# Altium schematic sheet ETH-PHY.SchDoc: TEBF0808 - ETHERNET
size A4; Organization: Trenz Electronic GmbH; DocumentNumber: TEBF0808; Revision: 04; SheetNumber: 20; SheetTotal: 36; Date: 2016-09-29; CompanyName: Trenz Electronic GmbH
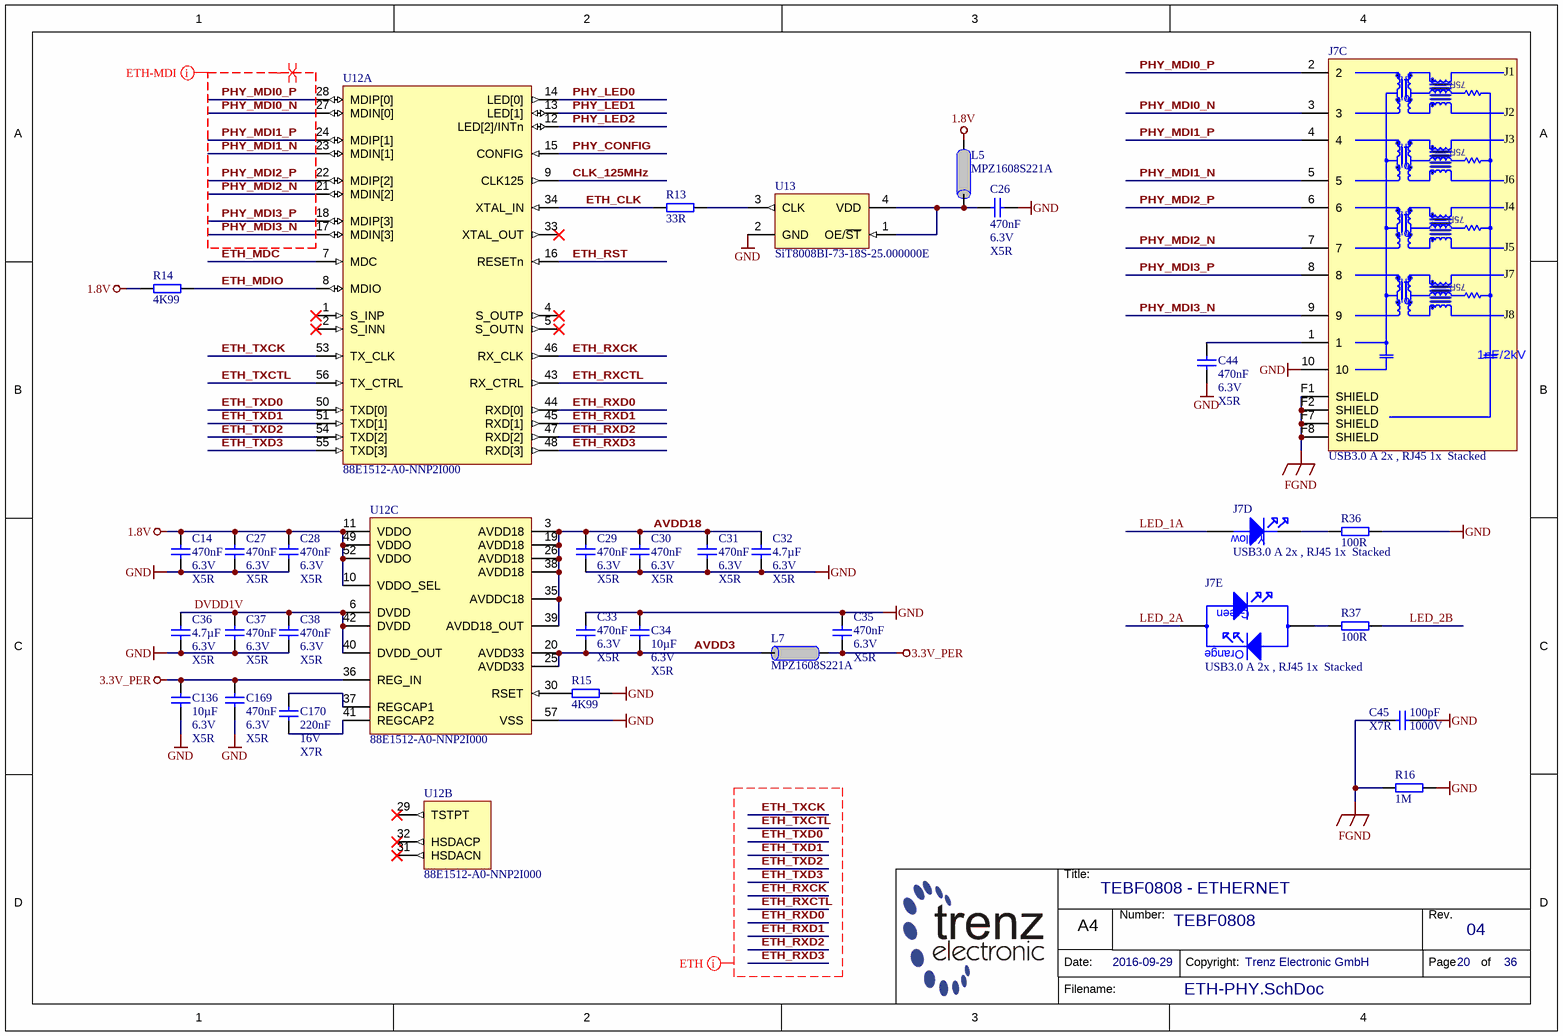
[diagram p0: ETH-PHY.SchDoc]

## Parts
C14  470nF  Voltage: 6.3V  Technology: X5R  [CAPC1005X55N]
C26  470nF  Voltage: 6.3V  Technology: X5R  [CAPC1005X55N]
C27  470nF  Voltage: 6.3V  Technology: X5R  [CAPC1005X55N]
C28  470nF  Voltage: 6.3V  Technology: X5R  [CAPC1005X55N]
C29  470nF  Voltage: 6.3V  Technology: X5R  [CAPC1005X55N]
C30  470nF  Voltage: 6.3V  Technology: X5R  [CAPC1005X55N]
C31  470nF  Voltage: 6.3V  Technology: X5R  [CAPC1005X55N]
C32  4.7µF  Voltage: 6.3V  Technology: X5R  [CAPC1005X60N]
C33  470nF  Voltage: 6.3V  Technology: X5R  [CAPC1005X55N]
C34  10µF  Voltage: 6.3V  Technology: X5R  [CAPC1608X90N]
C35  470nF  Voltage: 6.3V  Technology: X5R  [CAPC1005X55N]
C36  4.7µF  Voltage: 6.3V  Technology: X5R  [CAPC1005X60N]
C37  470nF  Voltage: 6.3V  Technology: X5R  [CAPC1005X55N]
C38  470nF  Voltage: 6.3V  Technology: X5R  [CAPC1005X55N]
C44  470nF  Voltage: 6.3V  Technology: X5R  [CAPC1005X55N]
C45  100pF  Voltage: X7R  Technology: 1000V  [CAPC3216X180N]
C136  10µF  Voltage: 6.3V  Technology: X5R  [CAPC1608X90N]
C169  470nF  Voltage: 6.3V  Technology: X5R  [CAPC1005X55N]
C170  220nF  Voltage: 16V  Technology: X7R  [CAPC1005X55N]
J7  USB3.0 A 2x , RJ45 1x  Stacked  [7497110616]  (parts C,D,E of 5)
L5  MPZ1608S221A  [INDC1608X95N]
L7  MPZ1608S221A  [INDC1608X95N]
R13  33R  [RESC1005X40N]
R14  4K99  [RESC1005X40N]
R15  4K99  [RESC1005X40N]
R16  1M  [RESC3216X65N]
R36  100R  [RESC1005X40N]
R37  100R  [RESC1005X40N]
U12  88E1512-A0-NNP2I000  [QFN50P800X800X100-57N]  (parts A,B,C of 3)
U13  SiT8008BI-73-18S-25.000000E  [2016]

## Nets
1.8V: C14.1 C27.1 C28.1 L5.1 R14.1 U12.10(VDDO_SEL) U12.11(VDDO) U12.49(VDDO) U12.52(VDDO)
3.3V_PER: C35.2 C136.1 C169.1 L7.1 U12.36(REG_IN)
FGND: C45.1 J7.F1(SHIELD) J7.F2(SHIELD) J7.F7(SHIELD) J7.F8(SHIELD) R16.1
GND: C14.2 C26.2 C27.2 C28.2 C29.2 C30.2 C31.2 C32.2 C33.1 C34.1 C35.1 C36.2 C37.2 C38.2 C44.2 C45.2 C136.2 C169.2 J7.10 R15.2 R16.2 R36.2 U12.57(VSS) U13.2(GND)
AVDD3: C33.2 C34.2 L7.2 U12.20(AVDD33) U12.25(AVDD33)
AVDD18: C29.1 C30.1 C31.1 C32.1 U12.3(AVDD18) U12.19(AVDD18) U12.26(AVDD18) U12.35(AVDDC18) U12.38(AVDD18) U12.39(AVDD18_OUT)
CLK_125MHz: U12.9(CLK125)
DVDD1V: C36.1 C37.1 C38.1 U12.6(DVDD) U12.40(DVDD_OUT) U12.42(DVDD)
ETH_CLK: R13.1 U12.34(XTAL_IN)
ETH_MDC: U12.7(MDC)
ETH_MDIO: R14.2 U12.8(MDIO)
ETH_RST: U12.16(RESETn)
ETH_RXCK: U12.46(RX_CLK)
ETH_RXCTL: U12.43(RX_CTRL)
ETH_RXD0: U12.44(RXD[0])
ETH_RXD1: U12.45(RXD[1])
ETH_RXD2: U12.47(RXD[2])
ETH_RXD3: U12.48(RXD[3])
ETH_TXCK: U12.53(TX_CLK)
ETH_TXCTL: U12.56(TX_CTRL)
ETH_TXD0: U12.50(TXD[0])
ETH_TXD1: U12.51(TXD[1])
ETH_TXD2: U12.54(TXD[2])
ETH_TXD3: U12.55(TXD[3])
LED_1A: J7.12
LED_2A: J7.14
LED_2B: R37.2
PHY_CONFIG: U12.15(CONFIG)
PHY_LED0: U12.14(LED[0])
PHY_LED1: U12.13(LED[1])
PHY_LED2: U12.12(LED[2]/INTn)
PHY_MDI0_N: J7.3 U12.27(MDIN[0])
PHY_MDI0_P: J7.2 U12.28(MDIP[0])
PHY_MDI1_N: J7.5 U12.23(MDIN[1])
PHY_MDI1_P: J7.4 U12.24(MDIP[1])
PHY_MDI2_N: J7.7 U12.21(MDIN[2])
PHY_MDI2_P: J7.6 U12.22(MDIP[2])
PHY_MDI3_N: J7.9 U12.17(MDIN[3])
PHY_MDI3_P: J7.8 U12.18(MDIP[3])
NetC26_1: C26.1 L5.2 U13.1(OE/~{ST}) U13.4(VDD)
NetC44_1: C44.1 J7.1
NetC170_1: C170.1 U12.37(REGCAP1)
NetC170_2: C170.2 U12.41(REGCAP2)
NetJ7_11: J7.11 R36.1
NetJ7_13: J7.13 R37.1
NetR13_2: R13.2 U13.3(CLK)
NetR15_1: R15.1 U12.30(RSET)

Not connected (* = marked no-connect by the designer): U12 1(S_INP)* 2(S_INN)* 4(S_OUTP)* 5(S_OUTN)* 29(TSTPT)* 31(HSDACN)* 32(HSDACP)* 33(XTAL_OUT)*

## Layout directives
differential pair: PHY_MDI0_N, PHY_MDI0_P, PHY_MDI1_N, PHY_MDI1_P, PHY_MDI2_N, PHY_MDI2_P, PHY_MDI3_N, PHY_MDI3_P
net class ETH-MDI: PHY_MDI0_N, PHY_MDI0_P, PHY_MDI1_N, PHY_MDI1_P, PHY_MDI2_N, PHY_MDI2_P, PHY_MDI3_N, PHY_MDI3_P
net class ETH: ETH_RXCK, ETH_RXCTL, ETH_RXD0, ETH_RXD1, ETH_RXD2, ETH_RXD3, ETH_TXCK, ETH_TXCTL, ETH_TXD0, ETH_TXD1, ETH_TXD2, ETH_TXD3

## Notes on the sheet
- Title:
- Number:
- Rev.
- Date:
- A4
- Copyright:
- Page
- of
- Filename:
- (in symbol 27271, part C) 75R; J1; J2; J3; J6; J4; J5; J8; 1nF/2kV
- (in symbol 27271, part D) Yellow
- (in symbol 27271, part E) Green; Orange

## Library data of the parts
C14 C26-C31 C33 C35 C37 C38 C169 = 23659: KON 470nF 6,3V X5R SMD; AN: 23659; Value: 470n; Mixed: SMT; Preferred: Yes; Case: 1005 (0402)
C32 C36 = 24719: KON 4.7µF 6.3V X5R SMD 20%; AN: 24719; Value: 4.7u; Mixed: SMT; Preferred: Yes; Case: 1005 (0402); Tolerance: 20%
C34 C136 = 22918: KON 10µF 6,3V X5R SMD; AN: 22918; Mixed: SMT; Value: 10u; Case: 1608 (0603)
C44 = 23659: KON 470nF 6,3V X5R SMD; AN: 23659; Mixed: SMT; Value: 470n; Preferred: Yes; Case: 1005 (0402)
C45 = 22679: KON 100pF 1000V X7R 10%; AN: 22679; Value: 100p; Preferred: Yes; Mixed: SMT; Case: 3216 (1206); Tolerance: 10%
C170 = 22768: KON 220nF 16V X7R SMD; AN: 22768; Mixed: SMT; Value: 220n; Case: 1005 (0402)
J7 = 27271: AN: 27271; Mixed: THT; Trenz-Stock: Yes; HelpURL: B:\AD\adlib\datasheet\7497110616; H-ART: 7497110616
L5 L7 = 22718: Ferritdurchführung MPZ1608S221A; AN: 22718; Mixed: SMT; Trenz-Stock: Yes; Value: 220 OHm @ 100MHz; Case: 1608 (0603); HelpURL: B:\AD\adlib\datasheet\MPZ1608; Preferred: Yes; H-ART: MPZ1608S221A
R13 = 22770: WID SMD 33R 1% 0,063W; AN: 22770; Mixed: SMT; Value: 33; Preferred: Yes; Tolerance: 1%; Case: 1005 (0402); Technology: TK100
R14 = 22754: WID SMD 4K99 1% 0,063W; AN: 22754; Mixed: SMT; Value: 4.99K; Preferred: Yes; Case: 1005 (0402); Tolerance: 1%; Technology: TK100
R15 = 22754: WID SMD 4K99 1% 0,063W; AN: 22754; Value: 4.99K; Mixed: SMT; Preferred: Yes; Case: 1005 (0402); Tolerance: 1%; Technology: TK100
R16 = 22757: WID SMD 1M 5% 0,25W; AN: 22757; Mixed: SMT; Preferred: Yes; Case: 3216 (1206); Value: 1M; Tolerance: 5%; Technology: TK100
R36 R37 = 22507: WID SMD 100R 1% 0,063W; AN: 22507; Mixed: SMT; Value: 100; Preferred: Yes; Case: 1005 (0402); Tolerance: 1%; Technology: TK100
U12 = 24652: AN: 24652; Trenz-Stock: Yes; Mixed: SMT; Case: QFN56; HelpURL: B:\AD\adlib\datasheet\NDA\88E1512; Preferred: Yes; H-ART: 88E1512-A0-NNP2I000
U13 = 27228: AN: 27228; Value: 25M; Mixed: SMT; Preferred: Yes; Voltage: 1.8V; Case: 2.0  x 1.6mm; HelpURL: B:\AD\adlib\datasheet\SiT8008; H-ART: SIT8008BI-73-18S-25.000000E